# EAGLE design Power-Bus (EAGLE 9.6.2)
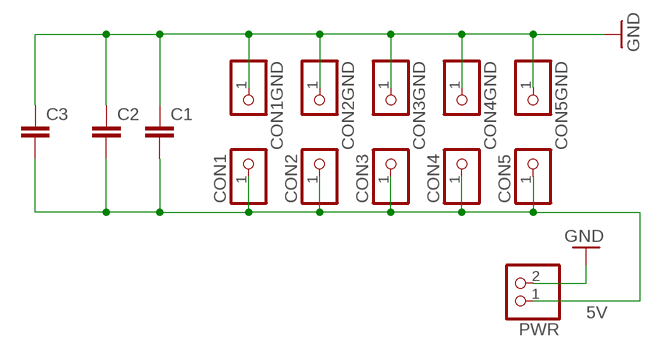
[diagram p0: schematic, sheet 1]

## Parts
C1  C-EU050-025X075  [C050-025X075]
C2  C-EU050-025X075  [C050-025X075]
C3  C-EU050-025X075  [C050-025X075]
CON1  PINHD-1X1  [1X01]
CON1GND  PINHD-1X1  [1X01]
CON2  PINHD-1X1  [1X01]
CON2GND  PINHD-1X1  [1X01]
CON3  PINHD-1X1  [1X01]
CON3GND  PINHD-1X1  [1X01]
CON4  PINHD-1X1  [1X01]
CON4GND  PINHD-1X1  [1X01]
CON5  PINHD-1X1  [1X01]
CON5GND  PINHD-1X1  [1X01]
PWR  PINHD-1X2/90  [1X02/90]

## Nets
5V: C1.2 C2.2 C3.2 CON1.1 CON2.1 CON3.1 CON4.1 CON5.1 PWR.1
GND: C1.1 C2.1 C3.1 CON1GND.1 CON2GND.1 CON3GND.1 CON4GND.1 CON5GND.1 PWR.2

## Library data of the parts
C1-C3 = rcl:C-EU: CAPACITOR, European symbol; SPICEPREFIX: C
CON1 CON1GND CON2 CON2GND CON3 CON3GND CON4 CON4GND CON5 CON5GND = pinhead:PINHD-1X1: PIN HEADER
PWR = pinhead:PINHD-1X2: PIN HEADER

## Board
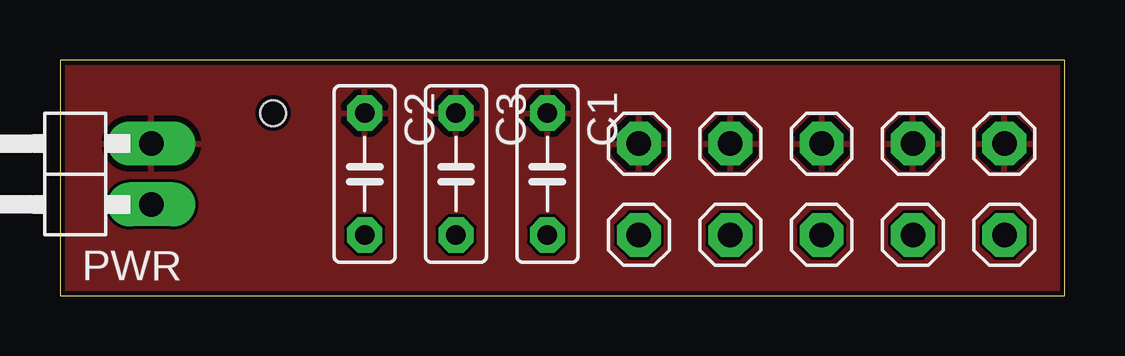
[diagram p1: board, top side]
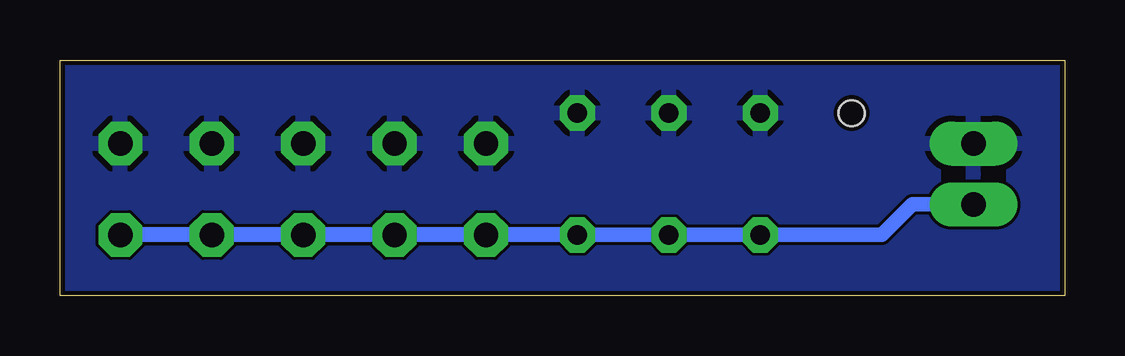
[diagram p2: board, bottom side, seen from below]

Size 41.89 x 9.83 mm. Coordinates in mm from the lower left corner, seen from the top.
Outline: 0,0 41.89,0 41.89,9.83 0,9.83 0,0
Copper layers (1*16): Top 0.035mm / dielectric 1.6mm / Bottom 0.035mm
Design rules "jlcpcb-2layers": minimum track width 5mil, minimum drill 0.3mm, track to track 5mil, track to pad 5mil, pad to pad 5mil, via to via 5mil, smd to smd 5mil, copper to edge 0.2mm, drill to drill 6mil, minimum pad ring 10mil, minimum via ring 3mil, stop-mask expansion 4mil, vias tented up to drill 0mil, thermal gap 10mil
Holes 1.07 mm at 8.89,7.62

### Footprints (pad centres in the part's own frame; a part is rotated, then mirrored left to right if it is on the bottom)
C050-025X075 = drill 0.813 octagon: 1 -2.54,0; 2 2.54,0
1X01 = drill 1.016 octagon: 1 0,0
1X02/90 = drill 1.016 long: 1 -1.27,-3.81; 2 1.27,-3.81

### Placement (x,y rotation side)
C1  20.32,5.08 270 top
C2  12.7,5.08 270 top
C3  16.51,5.08 270 top
CON1  39.37,2.54 0 top
CON1GND  24.13,6.35 0 top
CON2  35.56,2.54 0 top
CON2GND  27.94,6.35 0 top
CON3  31.75,2.54 0 top
CON3GND  31.75,6.35 0 top
CON4  27.94,2.54 0 top
CON4GND  35.56,6.35 0 top
CON5  24.13,2.54 0 top
CON5GND  39.37,6.35 0 top
PWR  0,5.08 90 top

### Tracks (layer width: path | path; a pad name or v marks a point on that pad's centre or on a via)
5V
  Bottom 0.61: C1.2 C3.2 C2.2 7.62,2.54 6.35,3.81 PWR.1
  Bottom 0.635: C1.2 CON5.1 CON4.1 CON3.1 CON2.1 CON1.1
GND
  pour Bottom: 41.91,10.16 41.91,0 0,0 0,10.16
  pour Top: 0,10.16 41.91,10.16 41.91,0 0,0